# Altium schematic sheet FIT_HDMI_X22-18.SchDoc: FIT_PM12 board
size 420 x 297 mm; CheckedBy: G.Kasprowicz; Author: INR Moscow; CompanyName: WUT ISE; DrawnBy: M.Podgórski; Organization: WUT ISE; Address1: PW ISE; Address2: Nowowiejska 15/19 00-665 Warsaw; Address3: gkasprow@gmail.com; Revision: 2; SheetNumber: -; SheetTotal: -; ModifiedBy: -; CheckedDate: -; Title2: Title 2; DivGrp: WUT ISE; Designer: INR RAS; ModifiedDate: -; ProjectName: Sensor Box
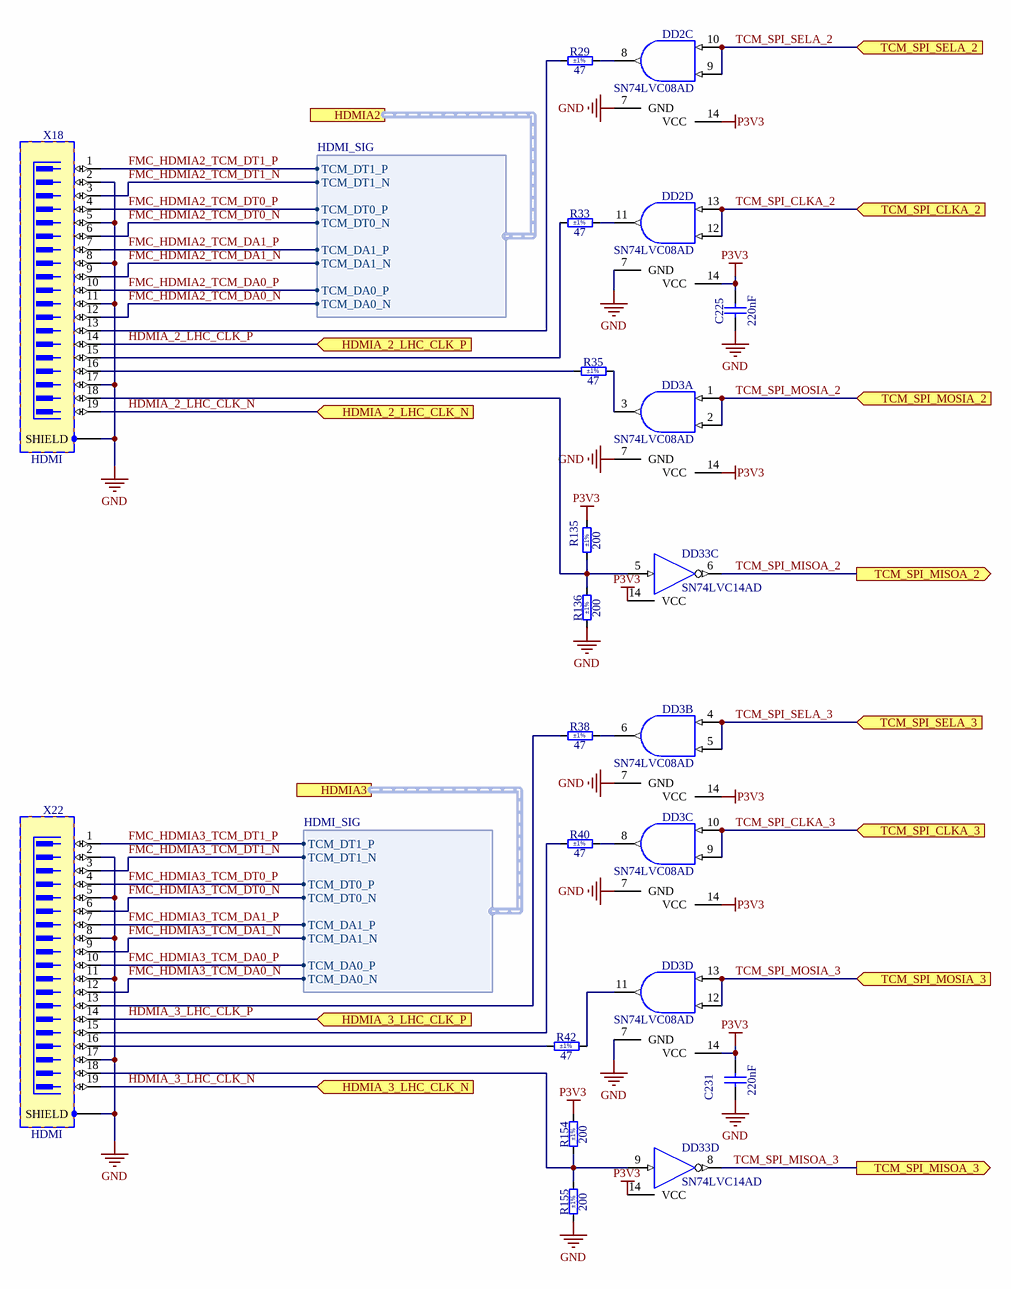
[diagram p0: FIT_HDMI_X22-18.SchDoc]

## Parts
C225  220nF  [CAPC2012X135N]
C231  220nF  [CAPC2012X135N]
DD2  SN74LVC08AD  [SOIC127P600X175-14N]  (parts C,D of 4)
DD3  SN74LVC08AD  [SOIC127P600X175-14N]  (parts A,B,C,D of 4)
DD33  SN74LVC14AD  [SOIC127P600X175-14N]  (parts C,D of 6)
R29  47  Tolerance: ±1%  [RESC2012X60N]
R33  47  Tolerance: ±1%  [RESC2012X60N]
R35  47  Tolerance: ±1%  [RESC2012X60N]
R38  47  Tolerance: ±1%  [RESC2012X60N]
R40  47  Tolerance: ±1%  [RESC2012X60N]
R42  47  Tolerance: ±1%  [RESC2012X60N]
R135  200  Tolerance: ±1%  [RESC2012X60N]
R136  200  Tolerance: ±1%  [RESC2012X60N]
R154  200  Tolerance: ±1%  [RESC2012X60N]
R155  200  Tolerance: ±1%  [RESC2012X60N]
X18  HDMI  [TYCO_2007435-1]
X22  HDMI  [TYCO_2007435-1]

## Ports
HDMIA2 (harness HDMI_SIG), HDMIA3 (harness HDMI_SIG), HDMIA_2_LHC_CLK_N (in), HDMIA_2_LHC_CLK_P (in), HDMIA_3_LHC_CLK_N (in), HDMIA_3_LHC_CLK_P (in), TCM_SPI_CLKA_2 (in), TCM_SPI_CLKA_3 (in), TCM_SPI_MISOA_2 (out), TCM_SPI_MISOA_3 (out), TCM_SPI_MOSIA_2 (in), TCM_SPI_MOSIA_3 (in), TCM_SPI_SELA_2 (in), TCM_SPI_SELA_3 (in)

## Harnesses
HDMI_SIG: TCM_DT1_P, TCM_DT1_N, TCM_DT0_P, TCM_DT0_N, TCM_DA1_P, TCM_DA1_N, TCM_DA0_P, TCM_DA0_N

## Nets
GND: C225.1 C231.1 DD2.7(GND) DD3.7(GND) DD33.7(GND) R136.1 R155.1 X18.2 X18.5 X18.8 X18.11 X18.17 X18.SHIELD X22.2 X22.5 X22.8 X22.11 X22.17 X22.SHIELD
P3V3: C225.2 C231.2 DD2.14(VCC) DD3.14(VCC) DD33.14(VCC) R135.2 R154.2  [also labelled VCC]
FMC_HDMIA2_TCM_DA0_N: X18.12 ; port HDMIA2.TCM_DA0_N
FMC_HDMIA2_TCM_DA0_P: X18.10 ; port HDMIA2.TCM_DA0_P
FMC_HDMIA2_TCM_DA1_N: X18.9 ; port HDMIA2.TCM_DA1_N
FMC_HDMIA2_TCM_DA1_P: X18.7 ; port HDMIA2.TCM_DA1_P
FMC_HDMIA2_TCM_DT0_N: X18.6 ; port HDMIA2.TCM_DT0_N
FMC_HDMIA2_TCM_DT0_P: X18.4 ; port HDMIA2.TCM_DT0_P
FMC_HDMIA2_TCM_DT1_N: X18.3 ; port HDMIA2.TCM_DT1_N
FMC_HDMIA2_TCM_DT1_P: X18.1 ; port HDMIA2.TCM_DT1_P
FMC_HDMIA3_TCM_DA0_N: X22.12 ; port HDMIA3.TCM_DA0_N
FMC_HDMIA3_TCM_DA0_P: X22.10 ; port HDMIA3.TCM_DA0_P
FMC_HDMIA3_TCM_DA1_N: X22.9 ; port HDMIA3.TCM_DA1_N
FMC_HDMIA3_TCM_DA1_P: X22.7 ; port HDMIA3.TCM_DA1_P
FMC_HDMIA3_TCM_DT0_N: X22.6 ; port HDMIA3.TCM_DT0_N
FMC_HDMIA3_TCM_DT0_P: X22.4 ; port HDMIA3.TCM_DT0_P
FMC_HDMIA3_TCM_DT1_N: X22.3 ; port HDMIA3.TCM_DT1_N
FMC_HDMIA3_TCM_DT1_P: X22.1 ; port HDMIA3.TCM_DT1_P
HDMIA_2_LHC_CLK_N: X18.19 ; port HDMIA_2_LHC_CLK_N
HDMIA_2_LHC_CLK_P: X18.14 ; port HDMIA_2_LHC_CLK_P
HDMIA_3_LHC_CLK_N: X22.19 ; port HDMIA_3_LHC_CLK_N
HDMIA_3_LHC_CLK_P: X22.14 ; port HDMIA_3_LHC_CLK_P
TCM_SPI_CLKA_2: DD2.12(B) DD2.13(A) ; port TCM_SPI_CLKA_2
TCM_SPI_CLKA_3: DD3.9(B) DD3.10(A) ; port TCM_SPI_CLKA_3
TCM_SPI_MISOA_2: DD33.6(OUT) ; port TCM_SPI_MISOA_2
TCM_SPI_MISOA_3: DD33.8(OUT) ; port TCM_SPI_MISOA_3
TCM_SPI_MOSIA_2: DD3.1(A) DD3.2(B) ; port TCM_SPI_MOSIA_2
TCM_SPI_MOSIA_3: DD3.12(B) DD3.13(A) ; port TCM_SPI_MOSIA_3
TCM_SPI_SELA_2: DD2.9(B) DD2.10(A) ; port TCM_SPI_SELA_2
TCM_SPI_SELA_3: DD3.4(A) DD3.5(B) ; port TCM_SPI_SELA_3
NetDD2_8: DD2.8(Y) R29.2
NetDD2_11: DD2.11(Y) R33.2
NetDD3_3: DD3.3(Y) R35.2
NetDD3_6: DD3.6(Y) R38.2
NetDD3_8: DD3.8(Y) R40.2
NetDD3_11: DD3.11(Y) R42.2
NetDD33_5: DD33.5(IN) R135.1 R136.2 X18.18
NetDD33_9: DD33.9(IN) R154.1 R155.2 X22.18
NetR29_1: R29.1 X18.13
NetR33_1: R33.1 X18.15
NetR35_1: R35.1 X18.16
NetR38_1: R38.1 X22.13
NetR40_1: R40.1 X22.15
NetR42_1: R42.1 X22.16

## Notes on the sheet
- Project/Equipment
- Document
- Designer
- Drawn by
- Check.by
- Copyright WUT ISE 2024.
  This documentation describes Open Hardware and is licensed under the CERN OHL v.2. You may redistribute and modify this documentation under the terms of the CERN OHL v.2. (http://ohwr.org/CERNOHL). This documentation is distributed WITHOUT ANY EXPRESS OR IMPLIED WARRANTY, INCLUDING OF MERCHANTABILITY, SATISFACTORY QUALITY AND FITNESS FOR A PARTICULAR PURPOSE. Please see the CERN OHL v.2 for applicable conditions.
- Contact
- File
- Last Mod.
- Print Date
- Sheet
- Size
- A3
- of
- Rev

## Library data of the parts
C225 C231 = CC0805_220NF_50V_10%_X7R: Non-polarised capacitor; Part Description: SMD Multilayer Chip Ceramic Capacitor; Manufacturer: GENERIC; Manufacturer1 Part Number: GRM21BR71H224KA01L; Voltage: 50V; TC: X7R; Tolerance: ±10%; Part Number: CC0805_220NF_50V_10%_X7R; Component Kind: Standard; Component Type: Standard; Pin Count: 2; Value: 220nF; Status: Preferred; Manufacturer Part Number: CC0805_220NF_50V_10%_X7R; Case: 0805; Mounted: Yes; Socket: No; SMD: Yes; Sense: No; Manufacturer1 Example: MURATA; Manufacturer1 ComponentHeight: 1.35mm; HelpURL: \\cern.ch\dfs\Applications\Altium\Datasheets\CC0805_X7R_MURATA.pdf; Author: CERN DEM JLC; CreateDate: 03.12.2007; LatestRevisionDate: 03.12.2007
DD2 DD3 = SN74LVC08AD: Quad 2-Input AND Gate; Part Description: Quadruple 2-Input Positive-AND Gate; Manufacturer: TEXAS INSTRUMENTS; PressFit: No; Bonding: No; Part Number: SN74LVC08AD; Component Kind: Standard; Component Type: Standard; Device: SN74LVC08AD; PackageDescription: SOIC 14, Pitch 1.27mm - Body 4x8.75mm, IPC Medium Density; Manufacturer Part Number: SN74LVC08AD; Pin Count: 14; Case: SOIC14; Mounted: Yes; Socket: No; SMD: Yes; Sense: No; ComponentHeight: 1.75mm; Author: CERN DEM JLC; HelpURL: \\cern.ch\dfs\Applications\Altium\Datasheets\SN74LVC08AD.pdf; CreateDate: 21.03.2012; LatestRevisionDate: 21.03.2012
DD33 = SN74LVC14AD: Hex Schmitt-Trigger Inverter; Manufacturer: TEXAS INSTRUMENTS; PressFit: No; Bonding: No; Part Number: SN74LVC14AD; Component Kind: Standard; Component Type: Standard; Device: SN74LVC14AD; PackageDescription: SOIC 14, Pitch 1.27mm - Body 4x8.75mm, IPC Medium Density; Part Description: Hex Schmitt-Trigger Inverter; Manufacturer Part Number: SN74LVC14AD; Pin Count: 14; Case: SOIC14; Mounted: Yes; Socket: No; SMD: Yes; Sense: No; ComponentHeight: 1.75mm; Author: CERN DEM JMW; HelpURL: \\cern.ch\dfs\Applications\Altium\Datasheets\SN74LVC14AD.pdf; CreateDate: 29.09.2008; LatestRevisionDate: 29.09.2008
R29 R33 R35 R38 R40 R42 = R0805_47R_1%_0.125W_100PPM: Resistor - 1%; Part Description: General Purpose Thick Film Chip Resistor; Manufacturer: GENERIC; Manufacturer1 Part Number: NRC10F47R0TRF; Power: 0.125W; TC: ±100ppm/°C; PressFit: No; Part Number: R0805_47R_1%_0.125W_100PPM; Component Kind: Standard; Component Type: Standard; Pin Count: 2; Value: 47; Status: Preferred; Manufacturer Part Number: R0805_47R_1%_0.125W_100PPM; Case: 0805; Mounted: Yes; Sense: No; Socket: No; SMD: Yes; Manufacturer1 Example: NIC COMPONENT; Manufacturer1 ComponentHeight: 0.6mm; HelpURL: \\cern.ch\dfs\Applications\Altium\Datasheets\R0805_NIC_NRC.pdf; Author: CERN DEM JLC; CreateDate: 03.12.2007; LatestRevisionDate: 13.03.2008
R135 R136 R154 R155 = R0805_200R_1%_0.125W_100PPM: Resistor - 1%; Part Description: General Purpose Thick Film Chip Resistor; Manufacturer: GENERIC; Manufacturer1 Part Number: NRC10F2000TRF; Power: 0.125W; TC: ±100ppm/°C; PressFit: No; Part Number: R0805_200R_1%_0.125W_100PPM; Component Kind: Standard; Component Type: Standard; Pin Count: 2; Value: 200; Status: Preferred; Manufacturer Part Number: R0805_200R_1%_0.125W_100PPM; Case: 0805; Mounted: Yes; Sense: No; Socket: No; SMD: Yes; Manufacturer1 Example: NIC COMPONENT; Manufacturer1 ComponentHeight: 0.6mm; HelpURL: \\cern.ch\dfs\Applications\Altium\Datasheets\R0805_NIC_NRC.pdf; Author: CERN DEM JLC; CreateDate: 03.12.2007; LatestRevisionDate: 13.03.2008
X18 X22 = TYCO_2007435-1: Connector HDMI 19 Male + 1 Shield; Part Description: 0.578mm Pitch, Through-Hole Right Angle 19 Contacts Flag-HDMI Type-A Receptacle Thru Hole Mounting Pads; Manufacturer: TYCO ELECTRONICS; PressFit: No; Part Number: TYCO_2007435-1; Component Kind: Standard; Component Type: Standard; Pin Count: 23; Family: HDMI; Mounted: Yes; Socket: No; SMD: No; Sense: No; Status: None; Manufacturer Part Number: 2007435-1; ComponentHeight: 16.4mm; HelpURL: \\cern.ch\dfs\Applications\Altium\Datasheets\TYCO_2007435-1.pdf; Author: CERN DEM MR; CreateDate: 05.07.2016; LatestRevisionDate: 05.07.2016